# EAGLE design TPMS (EAGLE 7.7.0)
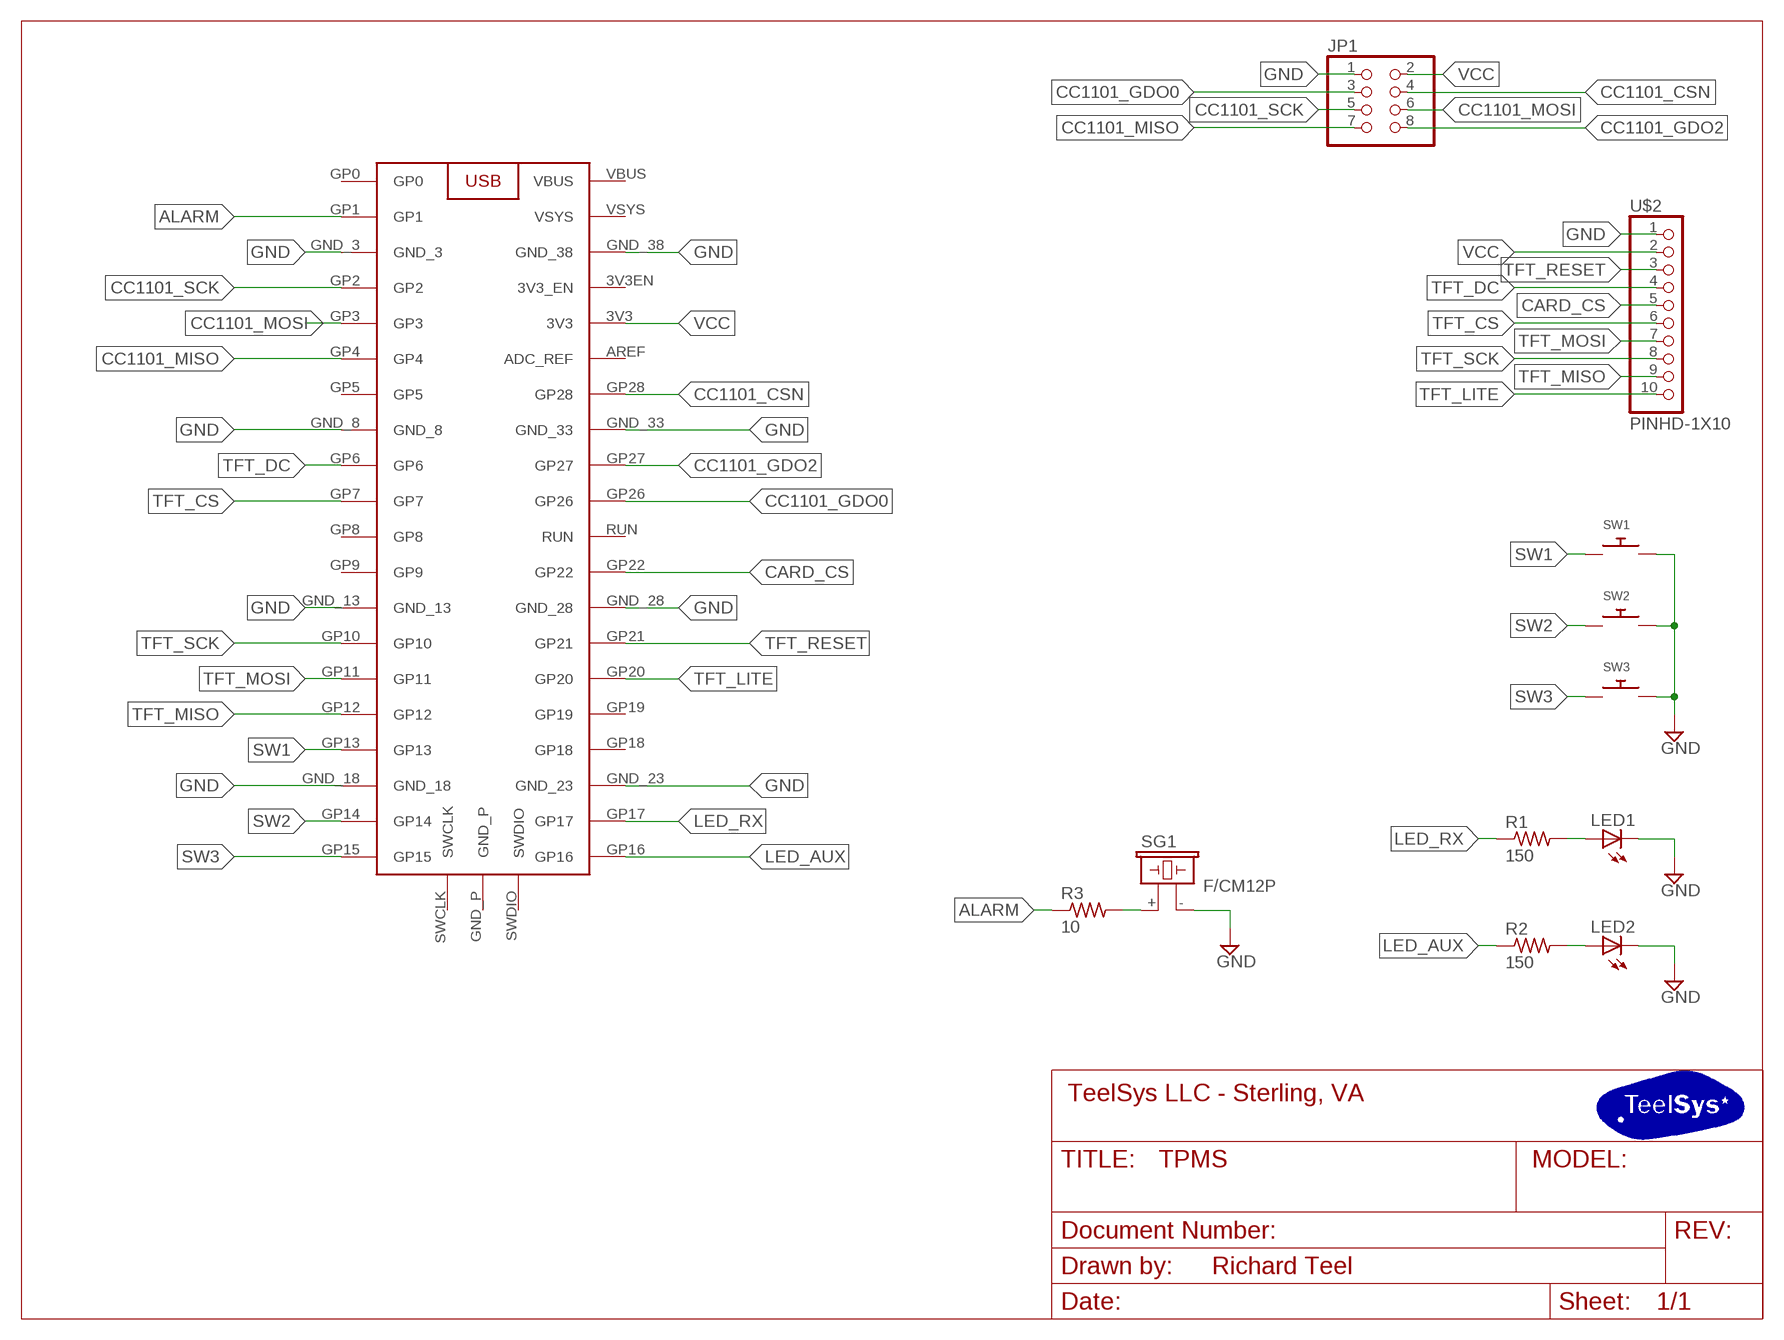
[diagram p0: schematic, sheet 1]
FRAME1 (LETTER_L): COMPANY_INFO: TeelSys LLC - Sterling, VA; DRAWN_BY: Richard Teel

## Parts
JP1  PINHD-2X4  [2X04]
LED1  LED3MM  [LED3MM]
LED2  LED3MM  [LED3MM]
R1  150  R-US_M0805  [M0805]
R2  150  R-US_M0805  [M0805]
R3  10  R-US_M0805  [M0805]
SG1  F/CM12P  [F/CM12P]
SW1  SWITCH_PUSHBUTTONEVQ-PE  [TACT_PANA-EVQ]
SW2  SWITCH_PUSHBUTTONEVQ-PE  [TACT_PANA-EVQ]
SW3  SWITCH_PUSHBUTTONEVQ-PE  [TACT_PANA-EVQ]
U$1  RASPBERRY_PI_PICORASPBERRY_PI_PICO  [RASPBERRY_PI_PICO]
U$2  PINHD-1X10  [1X10-BIG]

## Nets
ALARM: R3.1 U$1.GP1
CARD_CS: U$1.GP22 U$2.5
CC1101_CSN: JP1.4 U$1.GP28
CC1101_GDO0: JP1.3 U$1.GP26
CC1101_GDO2: JP1.8 U$1.GP27
CC1101_MISO: JP1.7 U$1.GP4
CC1101_MOSI: JP1.6 U$1.GP3
CC1101_SCK: JP1.5 U$1.GP2
GND: JP1.1 LED1.K(C) LED2.K(C) SG1.- SW1.P$2 SW2.P$2 SW3.P$2 U$1.GND_3 U$1.GND_8 U$1.GND_13 U$1.GND_18 U$1.GND_23 U$1.GND_28 U$1.GND_33 U$1.GND_38 U$2.1
LED_AUX: R2.1 U$1.GP16
LED_RX: R1.1 U$1.GP17
N$1: LED1.A R1.2
N$2: LED2.A R2.2
N$3: R3.2 SG1.+
SW1: SW1.P$1 U$1.GP13
SW2: SW2.P$1 U$1.GP14
SW3: SW3.P$1 U$1.GP15
TFT_CS: U$1.GP7 U$2.6
TFT_DC: U$1.GP6 U$2.4
TFT_LITE: U$1.GP20 U$2.10
TFT_MISO: U$1.GP12 U$2.9
TFT_MOSI: U$1.GP11 U$2.7
TFT_RESET: U$1.GP21 U$2.3
TFT_SCK: U$1.GP10 U$2.8
VCC: JP1.2 U$1.3V3 U$2.2
Unconnected: U$1.3V3EN(3V3_EN) U$1.AREF(ADC_REF) U$1.GND_P U$1.GP0 U$1.GP5 U$1.GP8 U$1.GP9 U$1.GP18 U$1.GP19 U$1.RUN U$1.SWCLK U$1.SWDIO U$1.VBUS U$1.VSYS

## Library data of the parts
JP1 = adafruit:PINHD-2X4: PIN HEADER
LED1 LED2 = adafruit:LED: LED OSRAM: - CHIPLED LG R971, LG N971, LY N971, LG Q971, LY Q971, LO R971, LY R971 LH N974, LH R974 LS Q976, LO Q976, LY Q976 LO Q996 - Hyper CHIPLED LW Q18S LB Q993, LB Q99A, LB R99A - SideLED LS A670, LO A670, LY A670, LG A670, LP A670 LB A673, LV A673, LT A673, LW A673 LH A674 LY A675 LS A676, LA A676, LO A676, LY A676, LW A676 LS A679, LY A679, LG A679 - Hyper Micro SIDELED® LS Y876, LA Y876, LO Y876, LY Y876 LT Y87S - SmartLED LW L88C, LW L88S LB L89C, LB L89S, LG L890 LS L89K, LO L89K, LY L89K LS L896, LA L896, LO L896, LY L896 - TOPLED LS T670, LO T670, LY T670, LG T670, LP T670 LSG T670, LSP T670, LSY T670, LOP T670, LYG T670 LG T671, LOG T671, LSG T671 LB T673, LV T673, LT T673, LW T673 LH T674 LS T676, LA T676, LO T676, LY T676, LB T676, LH T676, LSB T676, LW T676 LB T67C, LV T67C, LT T67C, LS T67K, LO T67K, LY T67K, LW E67C LS E67B, LA E67B, LO E67B, LY E67B, LB E67C, LV E67C, LT E67C LW T67C LS T679, LY T679, LG T679 LS T770, LO T770, LY T770, LG T770, LP T770 LB T773, LV T773, LT T773, LW T773 LH T774 LS E675, LA E675, LY E675, LS T675 LS T776, LA T776, LO T776, LY T776, LB T776 LHGB T686 LT T68C, LB T68C - Hyper Mini TOPLED® LB M676 - Mini TOPLED Santana® LG M470 LS M47K, LO M47K, LY M47K Source: http://www.osram.convergy.de/
R1-R3 = rcl:R-US_: RESISTOR, American symbol
SG1 = buzzer:F/CM12P: BUZZER Source: Buerklin; OC_FARNELL: unknown; OC_NEWARK: unknown
SW1-SW3 = adafruit:SWITCH_PUSHBUTTON: Buttons SOFTTOUCHSMD_SJ - Soft touch temporary push button (Super Junk Akihabara) Compatible with SKPMANE010 [Mouser: 688-SKPMAN] C&K_KSS = Digikey: KSS221GLFS
U$1 = teelsys-0.2:RASPBERRY_PI_PICO
U$2 = teelsys-0.2:PINHD-1X10: Pin header 1x10 0.1" spacing With round pins

## Board
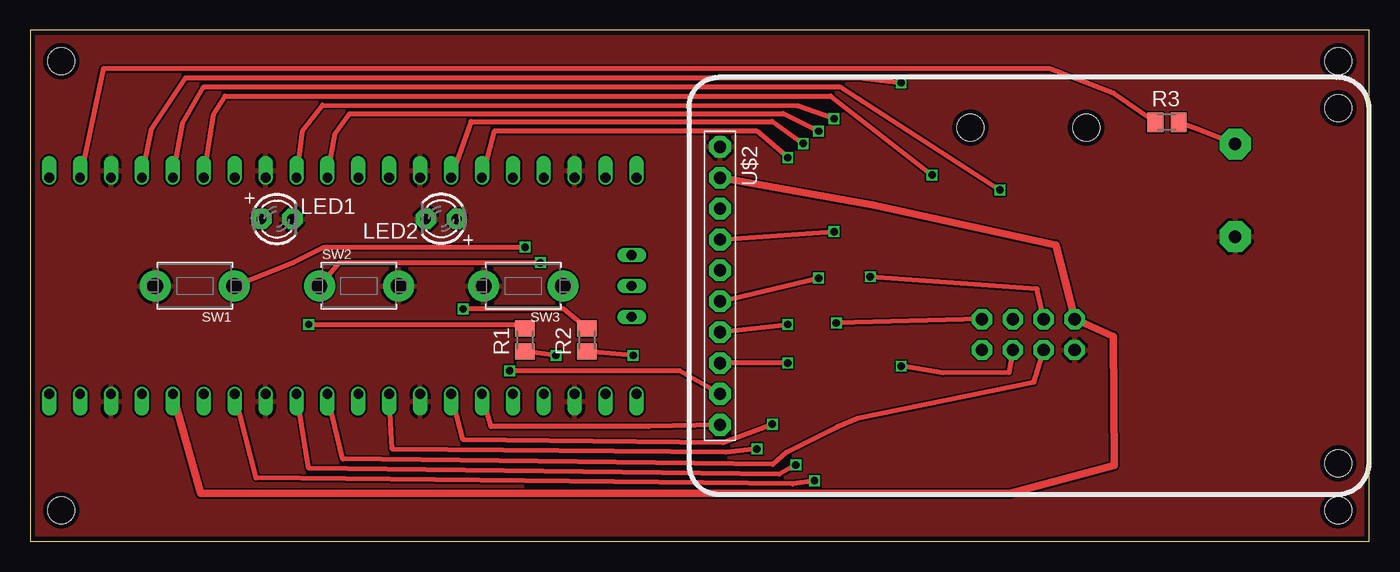
[diagram p1: board, top side]
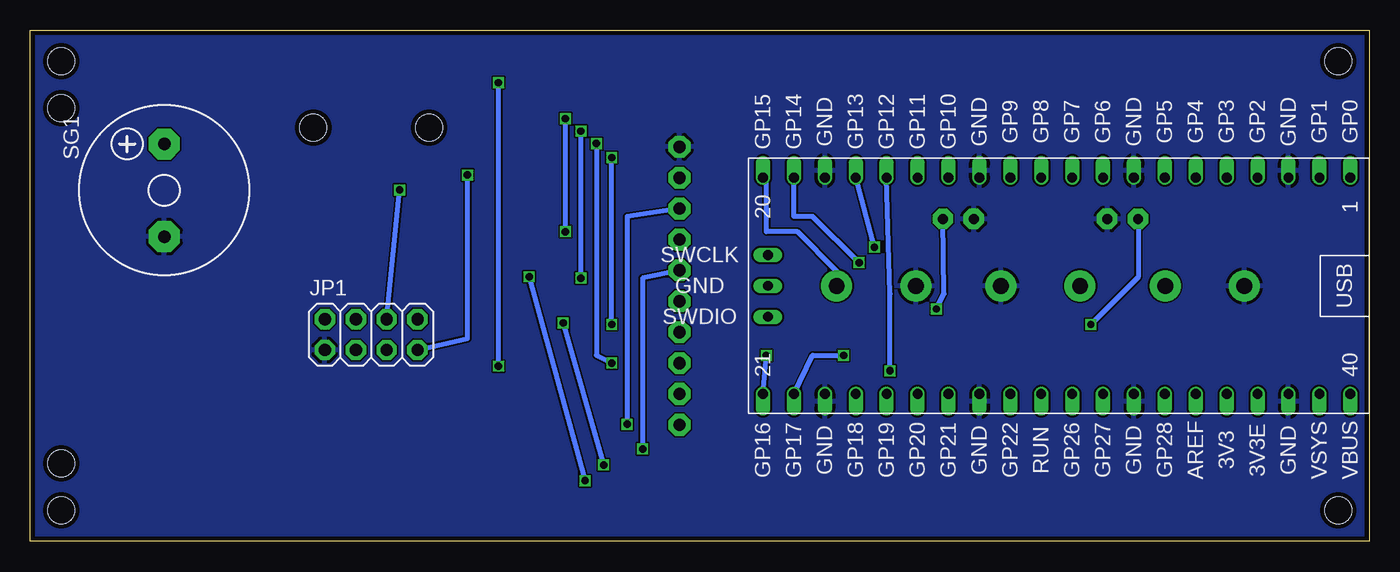
[diagram p2: board, bottom side, seen from below]

Size 110 x 42 mm. Coordinates in mm from the lower left corner, seen from the top.
Outline: 0,0 110,0 110,42 0,42 0,0
Copper layers (1*16): Top 0.035559375mm / dielectric 1.6mm / Bottom 0.035559375mm
Design rules "oshpark-2layer2020": minimum track width 6mil, minimum drill 10mil, track to track 6mil, track to pad 6mil, pad to pad 6mil, via to via 6mil, smd to smd 6mil, copper to edge 15mil, drill to drill 6mil, minimum pad ring 5mil, minimum via ring 5mil, stop-mask expansion 2.5mil, vias tented up to drill 0mil, thermal gap 10mil
Holes 2.2 mm at 107.46,35.6 107.46,6.39 107.46,2.54 107.46,39.46 2.54,39.46 2.54,2.54 77.25,34 86.75,34

### Footprints (pad centres in the part's own frame; a part is rotated, then mirrored left to right if it is on the bottom)
2X04 = drill 1.016 pad 1.676 octagon: 1 -3.81,-1.27; 2 -3.81,1.27; 3 -1.27,-1.27; 4 -1.27,1.27; 5 1.27,-1.27; 6 1.27,1.27; 7 3.81,-1.27; 8 3.81,1.27
LED3MM = drill 0.813 pad 1.676 octagon: A -1.27,0; K 1.27,0
M0805 = smd 1.3 x 1.6: 1 -0.95,0; 2 0.95,0
F/CM12P = drill 1.016 pad 2.54 octagon: + 3.81,0; - -3.81,0
TACT_PANA-EVQ = drill 1.3 pad 2.54: P$1 -3.25,0; P$2 3.25,0
RASPBERRY_PI_PICO = drill 0.8 offset: 3V3 19.39,39.3; 3V3EN 19.39,41.84; AREF 19.39,36.76; GND_3 1.61,44.38; GND_8 1.61,31.68; GND_13 1.61,18.98; GND_18 1.61,6.28; GND_23 19.39,6.28; GND_28 19.39,18.98; GND_33 19.39,31.68; GND_38 19.39,44.38; GP0 1.61,49.46; GP1 1.61,46.92; GP2 1.61,41.84; GP3 1.61,39.3; GP4 1.61,36.76; GP5 1.61,34.22; GP6 1.61,29.14; GP7 1.61,26.6; GP8 1.61,24.06; GP9 1.61,21.52; GP10 1.61,16.44; GP11 1.61,13.9; GP12 1.61,11.36; GP13 1.61,8.82; GP14 1.61,3.74; GP15 1.61,1.2; GP16 19.39,1.2; GP17 19.39,3.74; GP18 19.39,8.82; GP19 19.39,11.36; GP20 19.39,13.9; GP21 19.39,16.44; GP22 19.39,21.52; GP26 19.39,26.6; GP27 19.39,29.14; GP28 19.39,34.22; RUN 19.39,24.06; VBUS 19.39,49.46; VSYS 19.39,46.92 | drill 0.8 long: GND_P 10.5,1.6; SWCLK 7.96,1.6; SWDIO 13.04,1.6
1X10-BIG = drill 1.016 pad 1.778 octagon: 1 -11.43,0; 2 -8.89,0; 3 -6.35,0; 4 -3.81,0; 5 -1.27,0; 6 1.27,0; 7 3.81,0; 8 6.35,0; 9 8.89,0; 10 11.43,0

### Placement (x,y rotation side)
JP1  82,17 0 bottom
LED1  20.25,26.5 0 top
LED2  33.75,26.5 180 top
R1  40.64,16.55 90 top
R2  45.72,16.55 90 top
R3  93.39,34.45 0 top
SG1  99,28.86 90 bottom
SW1  13.5,21 180 top
SW2  27,21 0 top
SW3  40.5,21 180 top
U$1  51,31.5 270 bottom
U$2  56.66,21 270 top

### Tracks (layer width: path | path; a pad name or v marks a point on that pad's centre or on a via)
ALARM
  Top 0.406: R3.1 89,36.85 83.75,38.85 6,38.85 U$1.GP1
CARD_CS  (via drill 0.6)
  Top 0.406: v59.69,7.58 57.15,7.32 29.73,7.57 U$1.GP22
  Bottom 0.406: U$2.5 59.69,21.64 v59.69,7.58
CC1101_CSN  (via drill 0.6)
  Top 0.406: JP1.4 82.71,20.75 v69.01,21.75 | v64.43,4.99 62.64,4.71 18.53,5.21 U$1.GP28
  Bottom 0.406: v69.01,21.75 v64.43,4.99
CC1101_GDO0
  Top 0.406: U$1.GP26 25.67,6.78 61.01,6.32 62.11,7.32 66.25,9.36 68,10.11 82.46,13.06 JP1.3
CC1101_GDO2  (via drill 0.6)
  Top 0.406: JP1.8 v66.22,17.95 | v62.89,6.28 61.52,5.5 22.88,6 U$1.GP27
  Bottom 0.406: v66.22,17.95 v62.89,6.28
CC1101_MISO  (via drill 0.6)
  Top 0.406: v74.09,30.11 65.75,36.6 16,36.6 15.05,35.12 U$1.GP4
  Bottom 0.406: JP1.7 74.09,16.66 v74.09,30.11
CC1101_MOSI  (via drill 0.6)
  Top 0.406: v79.67,28.89 66.5,37.35 14.25,37.35 12.51,34.38 U$1.GP3
  Bottom 0.406: JP1.6 v79.67,28.89
CC1101_SCK  (via drill 0.6)
  Top 0.406: JP1.5 80.42,13.88 75,13.86 v71.55,14.39 | v71.55,37.7 68,38.1 12.75,38.1 9.97,33.92 U$1.GP2
  Bottom 0.406: v71.55,14.39 v71.55,37.7
GND
  pour Top: 0,0 110,0 110,42 0,42
  pour Bottom: 0,0 110,0 110,42 0,42
LED_AUX  (via drill 0.6)
  Top 0.406: v49.53,15.29 R2.1
  Bottom 0.406: U$1.GP16 v49.53,15.29
LED_RX  (via drill 0.6)
  Top 0.406: v43.18,15.29 R1.1
  Bottom 0.406: U$1.GP17 45.72,15.29 v43.18,15.29
N$1  (via drill 0.6)
  Top 0.406: v22.86,17.82 40.32,17.82 R1.2
  Bottom 0.406: LED1.A 18.97,21.71 v22.86,17.82
N$2  (via drill 0.6)
  Top 0.406: R2.2 43.81,19.09 v35.56,19.09
  Bottom 0.406: v35.56,19.09 34.92,20.36 LED2.A
N$3
  Top 0.406: SG1.+ 96,33.85 R3.2
SW1  (via drill 0.6)
  Top 0.406: SW1.P$1 21.59,22.91 24.13,24.18 v40.64,24.18
  Bottom 0.406: v40.64,24.18 U$1.GP13
SW2  (via drill 0.6)
  Top 0.406: SW2.P$1 25.4,22.91 v41.91,22.91
  Bottom 0.406: U$1.GP14 47.26,26.71 45.72,26.71 v41.91,22.91
SW3
  Bottom 0.406: SW3.P$1 43.73,22.19 46.99,25.45 49.53,25.45 49.53,29.62 U$1.GP15
TFT_CS  (via drill 0.6)
  Top 0.406: U$2.6 v64.77,21.64 | v64.77,33.72 61.87,35.16 26.21,35.15 25.04,33.51 U$1.GP7
  Bottom 0.406: v64.77,21.64 v64.77,33.72
TFT_DC  (via drill 0.6)
  Top 0.406: U$2.4 v66.04,25.45 | v66.04,34.74 63,35.8 24,35.85 22.38,33.78 U$1.GP6
  Bottom 0.406: v66.04,25.45 v66.04,34.74
TFT_LITE
  Top 0.406: U$2.10 50.8,9.44 37.85,9.44 U$1.GP20
TFT_MISO  (via drill 0.6)
  Top 0.406: U$2.9 53.34,14.02 v39.37,14.02
  Bottom 0.406: v39.37,14.02 39.37,20.36 U$1.GP12
TFT_MOSI  (via drill 0.6)
  Top 0.406: U$2.7 v62.23,17.82 | v62.23,31.55 59.69,33.7 38.1,33.7 U$1.GP11
  Bottom 0.406: v62.23,17.82 v62.23,31.55
TFT_RESET  (via drill 0.6)
  Top 0.406: v60.96,9.62 56.9,8.11 35.56,8.36 U$1.GP21
  Bottom 0.406: U$2.3 60.96,26.71 v60.96,9.62
TFT_SCK  (via drill 0.6)
  Top 0.406: v63.5,32.7 60.96,34.51 36.2,34.51 U$1.GP10 | v62.23,14.65 U$2.8
  Bottom 0.406: v63.5,32.7 63.5,15.29 v62.23,14.65
VCC
  Top 0.61: U$2.2 69.28,27.64 84.25,24.36 JP1.2 89,16.86 89.06,6.24 80.49,3.94 75.7,3.92 13.97,3.92 U$1.3V3